# Altium project RiskChemi_Sensors_V2.03.PrjPcb
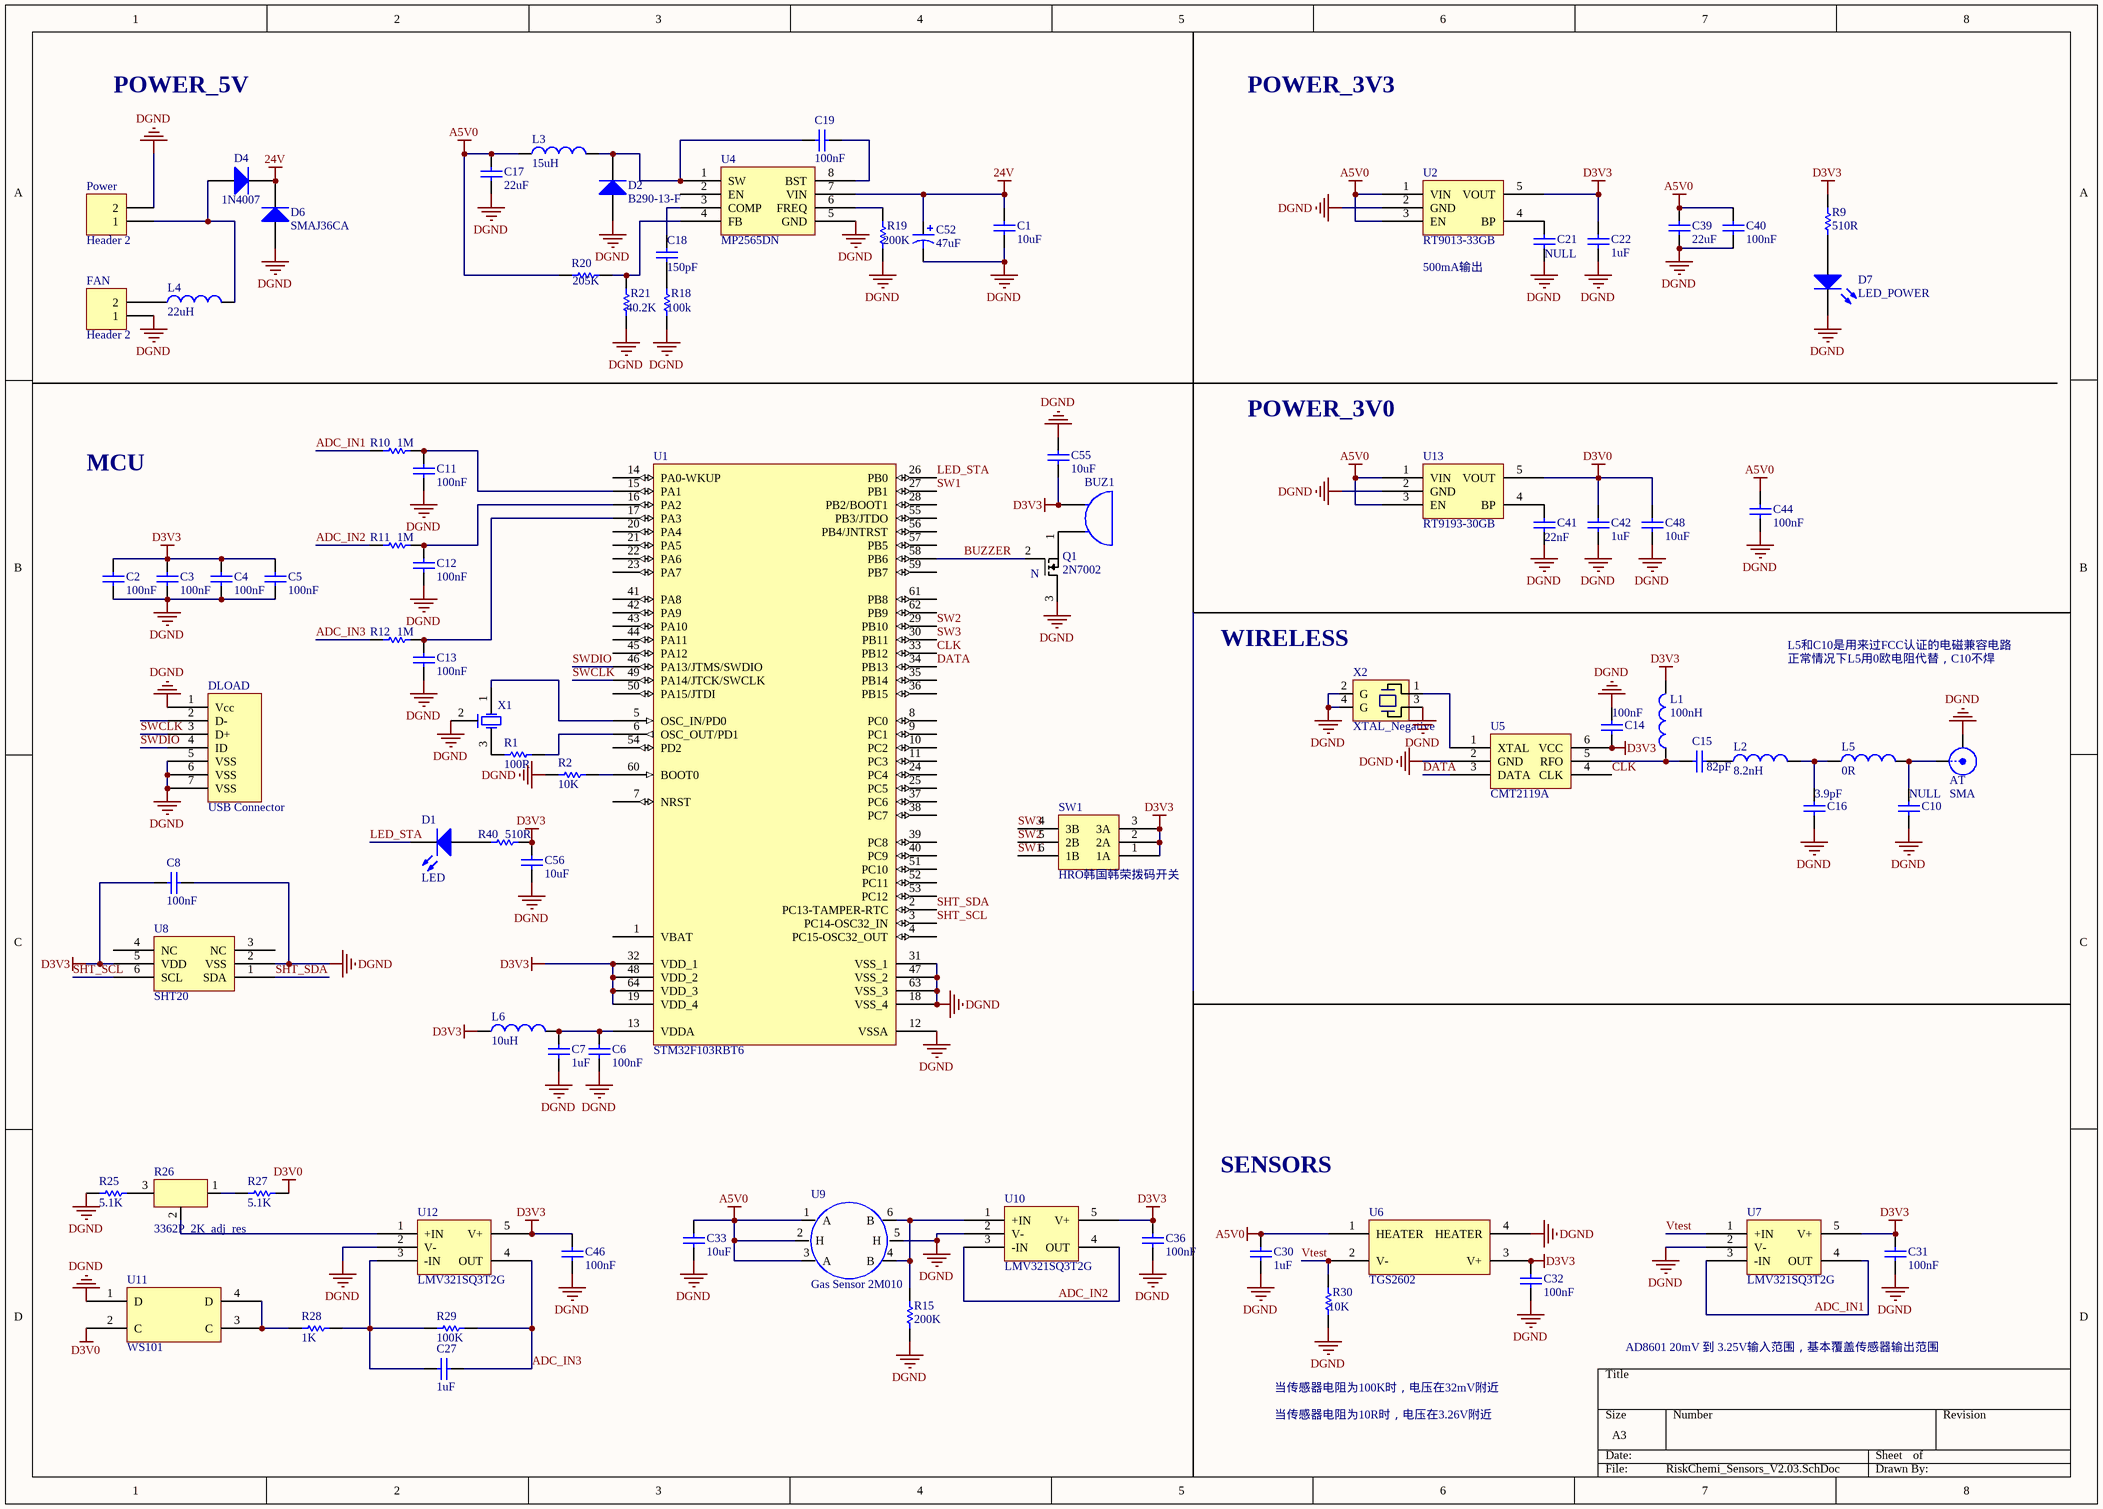
[diagram p0: RiskChemi_Sensors_V2.03.SchDoc]
1 sheet, 86 parts. Net scope: global (net labels, ports and power ports of the same name join across sheets).
Board file: RiskChemi_Sensors_V2.03.PcbDoc

## Sheet RiskChemi_Sensors_V2.03.SchDoc
size A3

### Parts
AT  SMA  [SMA]
BUZ1  BUZZER 0905 through hole  [BUZ0905]  (value not drawn)
C1  10uF  [0805]
C2  100nF  [0603]
C3  100nF  [0603]
C4  100nF  [0603]
C5  100nF  [0603]
C6  100nF  [0603]
C7  1uF  [0603]
C8  100nF  [0603]
C10  NULL  [0402]
C11  100nF  [0603]
C12  100nF  [0603]
C13  100nF  [0603]
C14  100nF  [0402]
C15  82pF  [0402]
C16  3.9pF  [0402]
C17  22uF  [0805]
C18  150pF  [0603]
C19  100nF  [0603]
C21  NULL  [0402]
C22  1uF  [0402]
C27  1uF  [0603]
C30  1uF  [0603]
C31  100nF  [0603]
C32  100nF  [0603]
C33  10uF  [0805]
C36  100nF  [0603]
C39  22uF  [1206]
C40  100nF  [0402]
C41  22nF  [0402]
C42  1uF  [0402]
C44  100nF  [0402]
C46  100nF  [0603]
C48  10uF  [0805]
C52  47uF  [cap_pol_8*10.2]
C55  10uF  [0805]
C56  10uF  [0805]
D1  LED  [1206_LED]
D2  B290-13-F  [B290]
D4  1N4007  [6032_pol]
D6  SMAJ36CA  [B290]
D7  LED_POWER  [1206_LED]
DLOAD  USB Connector  [Mini_USB]
FAN  Header 2  [HDR1X2]
L1  100nH  [0603C]
L2  8.2nH  [0603C]
L3  15uH  [4*4 Inductor]
L4  22uH  [10*10Inductor]
L5  0R  [0603C]
L6  10uH  [0805]
Power  Header 2  [HDR1X2]
Q1  2N7002  [2N7002]
R1  100R  [0603]
R2  10K  [0603]
R9  510R  [0603]
R10  1M  [0603]
R11  1M  [0603]
R12  1M  [0603]
R15  value 200K  [0603C]  (hidden comment: Res1)
R18  100k  [0603]
R19  200K  [0402]
R20  205K  [0603]
R21  40.2K  [0603]
R25  5.1K  [0603]
R26  3362P_2K_adj_res  [res_adj]
R27  5.1K  [0603]
R28  1K  [0603]
R29  100K  [0603]
R30  10K  [0603]
R40  510R  [0603]
SW1  HRO韩国韩荣拨码开关  [SW_6P_HRO]
U1  STM32F103RBT6  [LQFP64_N]
U2  RT9013-33GB  [SOT-23-5]
U4  MP2565DN  [so-8]
U5  CMT2119A  [sot23-6]
U6  TGS2602  [Gas Sensor TGS2602 Slot]
U7  LMV321SQ3T2G  [SC-70-5]
U8  SHT20  [SHT20]
U9  Gas Sensor 2M010  [Gas Sensor 2M010 Slot]
U10  LMV321SQ3T2G  [SC-70-5]
U11  WS101  [Gas_Sensor_WS101_Slot]
U12  LMV321SQ3T2G  [SC-70-5]
U13  RT9193-30GB  [SOT-23-5]
X1  8M smd  [8Mhz_XTAL]  (value not drawn)
X2  XTAL_Negative  [XTAL3225]

### Nets
24V: C1.2 C52.1 D4.2(K) D6.2(K) U4.7(VIN)
A5V0: C17.2 C30.2 C33.2 C39.1 C40.2 C44.2 L3.1 R20.2 U2.1(VIN) U2.3(EN) U6.1(HEATER) U9.1(A) U9.2(H) U9.3(A) U13.1(VIN) U13.3(EN)
D3V0: C42.2 C48.2 R27.2 U11.2(C) U13.5(VOUT)
D3V3: BUZ1.1(A) C2.2 C3.2 C4.2 C5.2 C8.2 C14.2 C22.2 C31.2 C32.2 C36.2 C46.2 C55.2 C56.2 L1.2 L6.1 R9.2 R40.2 SW1.1(1A) SW1.2(2A) SW1.3(3A) U1.19(VDD_4) U1.32(VDD_1) U1.48(VDD_2) U1.64(VDD_3) U2.5(VOUT) U5.6(VCC) U6.3(V+) U7.5(V+) U8.5(VDD) U10.5(V+) U12.5(V+)
DGND: AT.2(Y) C1.1 C2.1 C3.1 C4.1 C5.1 C6.1 C7.1 C8.1 C10.1 C11.2 C12.1 C13.1 C14.1 C16.1 C17.1 C21.1 C22.1 C30.1 C31.1 C32.1 C33.1 C36.1 C39.2 C40.1 C41.1 C42.1 C44.1 C46.1 C48.1 C52.2 C55.1 C56.1 D2.1(A) D6.1(A) D7.2(K) DLOAD.1(Vcc) DLOAD.5(VSS) DLOAD.6(VSS) DLOAD.7(VSS) FAN.1 Power.2 Q1.3(S) R2.1 R15.2 R18.1 R19.1 R21.1 R25.1 R30.1 U1.12(VSSA) U1.18(VSS_4) U1.31(VSS_1) U1.47(VSS_2) U1.63(VSS_3) U2.2(GND) U4.5(GND) U5.2(GND) U6.4(HEATER) U7.2(V-) U8.2(VSS) U9.5(H) U10.2(V-) U11.1(D) U12.2(V-) U13.2(GND) X1.2(GND) X2.2(G) X2.3 X2.4(G)
ADC_IN1: R10.1 U7.3(-IN) U7.4(OUT)
ADC_IN2: R11.1 U10.3(-IN) U10.4(OUT)
ADC_IN3: C27.1 R12.1 R29.2 U12.4(OUT)
BUZZER: Q1.2(G) U1.58(PB6)
CLK: U1.33(PB12) U5.4(CLK)
DATA: U1.34(PB13) U5.3(DATA)
LED_STA: D1.2(K) U1.26(PB0)
SHT_SCL: U1.3(PC14-OSC32_IN) U8.6(SCL)
SHT_SDA: U1.2(PC13-TAMPER-RTC) U8.1(SDA)
SW1: SW1.6(1B) U1.27(PB1)
SW2: SW1.5(2B) U1.29(PB10)
SW3: SW1.4(3B) U1.30(PB11)
SWCLK: DLOAD.3(D+) U1.49(PA14/JTCK/SWCLK)
SWDIO: DLOAD.4(ID) U1.46(PA13/JTMS/SWDIO)
Vtest: R30.2 U6.2(V-) U7.1(+IN)
NetAT_1: AT.1(X) C10.2 L5.2
NetBUZ1_2: BUZ1.2(B) Q1.1(D)
NetC6_2: C6.2 C7.2 L6.2 U1.13(VDDA)
NetC11_1: C11.1 R10.2 U1.15(PA1)
NetC12_2: C12.2 R11.2 U1.16(PA2)
NetC13_2: C13.2 R12.2 U1.17(PA3)
NetC15_1: C15.1 L1.1 U5.5(RFO)
NetC15_2: C15.2 L2.1
NetC16_2: C16.2 L2.2 L5.1
NetC18_1: C18.1 U4.3(COMP)
NetC18_2: C18.2 R18.2
NetC19_1: C19.1 U4.8(BST)
NetC19_2: C19.2 D2.2(K) L3.2 U4.1(SW)
NetC21_2: C21.2 U2.4(BP)
NetC27_2: C27.2 R28.2 R29.1 U12.3(-IN)
NetC41_2: C41.2 U13.4(BP)
NetD1_1: D1.1(A) R40.1
NetD4_1: D4.1(A) L4.2 Power.1
NetD7_1: D7.1(A) R9.1
NetFAN_2: FAN.2 L4.1
NetR1_1: R1.1 X1.3(OSC2)
NetR1_2: R1.2 U1.6(OSC_OUT/PD1)
NetR2_2: R2.2 U1.60(BOOT0)
NetR15_1: R15.1 U9.4(B) U9.6(B) U10.1(+IN)
NetR19_2: R19.2 U4.6(FREQ)
NetR20_1: R20.1 R21.2 U4.4(FB)
NetR25_2: R25.2 R26.3
NetR26_1: R26.1 R27.1
NetR26_2: R26.2 U12.1(+IN)
NetR28_1: R28.1 U11.3(C) U11.4(D)
NetU1_5: U1.5(OSC_IN/PD0) X1.1(OSC1)
NetU5_1: U5.1(XTAL) X2.1

Not connected (* = marked no-connect by the designer): DLOAD 2(D-); U1 1(VBAT) 4(PC15-OSC32_OUT) 7(NRST) 8(PC0) 9(PC1) 10(PC2) 11(PC3) 14(PA0-WKUP) 20(PA4) 21(PA5) 22(PA6) 23(PA7) 24(PC4) 25(PC5) 28(PB2/BOOT1) 35(PB14) 36(PB15) 37(PC6) 38(PC7) 39(PC8) 40(PC9) 41(PA8) 42(PA9) 43(PA10) 44(PA11) 45(PA12) 50(PA15/JTDI) 51(PC10) 52(PC11) 53(PC12) 54(PD2) 55(PB3/JTDO) 56(PB4/JNTRST) 57(PB5) 59(PB7) 61(PB8) 62(PB9); U4 2(EN); U8 3(NC) 4(NC)

### Notes on the sheet
- POWER_5V
- POWER_3V3
- (near U2) 500mA输出
- POWER_3V0
- MCU
- (near X2) WIRELESS
- L5和C10是用来过FCC认证的电磁兼容电路
- 正常情况下L5用0欧电阻代替，C10不焊
- SENSORS
- 当传感器电阻为100K时，电压在32mV附近
- AD8601 20mV 到 3.25V输入范围，基本覆盖传感器输出范围
- 当传感器电阻为10R时，电压在3.26V附近
- (in symbol N-MOSFET) N

### Library data of the parts
AT = SMB: SMB Straight Connector; LatestRevisionDate: 17-Jul-2002; LatestRevisionNote: Re-released for DXP Platform.; Publisher: Altium Limited
BUZ1 = BUZZER
C1 C17 = Cap: Capacitor,50V; Value: 100pF; Published: 8-Jun-2000; LatestRevisionDate: 17-Jul-2002; LatestRevisionNote: Re-released for DXP Platform.; PackageReference: RAD-0.3; Publisher: Altium Limited; PackageDescription: Radial Cap, Thru-Hole; 2 Leads; 0.3 in Pin Spacing
C2-C8 C11-C13 C18 C19 C21 C22 C27 C31 C32 C36 C39-C42 C44 C46 C48 C55 C56 = Cap: Capacitor; Value: 100pF; Published: 8-Jun-2000; Publisher: Altium Limited
  C2-C8 C11-C13 C18 C19 C21 C22 C27 C31 C32 C36 C40-C42 C44 C46 C48 C55 C56: LatestRevisionDate: 17-Jul-2002; LatestRevisionNote: Re-released for DXP Platform.; PackageReference: RAD-0.3; PackageDescription: Radial Cap, Thru-Hole; 2 Leads; 0.3 in Pin Spacing
  C39: Revision: July-2002: Re-released for DXP Platform.
C10 = Cap: Capacitor; Value: 3.9pF; Published: 8-Jun-2000; LatestRevisionDate: 17-Jul-2002; LatestRevisionNote: Re-released for DXP Platform.; PackageReference: RAD-0.3; Publisher: Altium Limited; PackageDescription: Radial Cap, Thru-Hole; 2 Leads; 0.3 in Pin Spacing
C14 = Cap: Capacitor; Value: 100nF,25V X7R; Published: 8-Jun-2000; LatestRevisionDate: 17-Jul-2002; LatestRevisionNote: Re-released for DXP Platform.; PackageReference: RAD-0.3; Publisher: Altium Limited; PackageDescription: Radial Cap, Thru-Hole; 2 Leads; 0.3 in Pin Spacing
C15 C16 C30 = Cap: Capacitor; Published: 8-Jun-2000; LatestRevisionDate: 17-Jul-2002; LatestRevisionNote: Re-released for DXP Platform.; PackageReference: RAD-0.3; Publisher: Altium Limited; PackageDescription: Radial Cap, Thru-Hole; 2 Leads; 0.3 in Pin Spacing
  C15: Value: 82pF
  C16: Value: 3.9pF
  C30: Value: 1uF
C33 = Cap: Capacitor; Value: 1uF; Published: 8-Jun-2000; LatestRevisionDate: 17-Jul-2002; LatestRevisionNote: Re-released for DXP Platform.; PackageReference: RAD-0.3; Publisher: Altium Limited; PackageDescription: Radial Cap, Thru-Hole; 2 Leads; 0.3 in Pin Spacing
C52 = Cap Pol1: Polarized Capacitor (Radial); Value: 100pF; Published: 8-Jun-2000; LatestRevisionDate: 17-Jul-2002; LatestRevisionNote: Re-released for DXP Platform.; PackageReference: RB7.6-15; Publisher: Altium Limited; PackageDescription: Polarized Capacitor (Radial); 2 Leads
D1 D7 = LED0: Typical INFRARED GaAs LED; Published: 8-Jun-2000; LatestRevisionDate: 08-Jul-2005; LatestRevisionNote: Mech Layer 1 removed.; PackageReference: LED-0; Publisher: Altium Limited; PackageDescription: LED; 2 Leads
D2 = Diode: Default Diode; Published: 8-Jun-2000; LatestRevisionDate: 17-Jul-2002; LatestRevisionNote: Re-released for DXP Platform.; PackageVersion: Sep-1996; PackageReference: SMC; Publisher: Altium Limited; PackageDescription: DO-214-AB/SMC; 2 C-Bend Leads; Body 7.9 x 5.9 mm, inc. leads (LxW); Code_JEDEC: DO-214-AB
D4 = Diode 1N4007: 1 Amp General Purpose Rectifier; Published: 8-Jun-2000; LatestRevisionDate: 17-Jul-2002; LatestRevisionNote: Re-released for DXP Platform.; DatasheetVersion: 1998; PackageVersion: Aug-1999; PackageReference: DO-41; Publisher: Altium Limited; PackageDescription: Diode, Axial; Body 5.2 x 2.7 mm (LxDia. max), Lead Dia. 0.86 mm (max); Code_JEDEC: DO-204-AL; ComponentLink1Description: Manufacturer Link; ComponentLink1URL: http://www.fairchildsemi.com/; ComponentLink2Description: Datasheet; ComponentLink2URL: http://www.fairchildsemi.com/ds/1N%2F1N4001.pdf
D6 = Diode 1N4007: 1 Amp General Purpose Rectifier; pin to pad: 1>2 2>1; Published: 8-Jun-2000; LatestRevisionDate: 17-Jul-2002; LatestRevisionNote: Re-released for DXP Platform.; DatasheetVersion: 1998; PackageVersion: Aug-1999; PackageReference: DO-41; Publisher: Altium Limited; PackageDescription: Diode, Axial; Body 5.2 x 2.7 mm (LxDia. max), Lead Dia. 0.86 mm (max); Code_JEDEC: DO-204-AL; ComponentLink1Description: Manufacturer Link; ComponentLink1URL: http://www.fairchildsemi.com/; ComponentLink2Description: Datasheet; ComponentLink2URL: http://www.fairchildsemi.com/ds/1N%2F1N4001.pdf
DLOAD = Component_1
FAN Power = Header 2: Header, 2-Pin; LatestRevisionDate: 17-Jul-2002; LatestRevisionNote: Re-released for DXP Platform.; Publisher: Altium Limited
L1 L2 = Inductor: Code_IEC: 1005; Published: 8-Jun-2000; LatestRevisionDate: 29-May-2009; LatestRevisionNote: IPC-7351 Footprint Added.; PackageReference: 0402-A; Publisher: Altium Limited; PackageDescription: Chip Inductor; Code_JEITA: 0402
  L1: Value: 100nH
  L2: Value: 8.2nH
L3 = Inductor: Inductor, 1A; Code_IEC: 1005; Published: 8-Jun-2000; LatestRevisionDate: 29-May-2009; LatestRevisionNote: IPC-7351 Footprint Added.; PackageReference: 0402-A; Publisher: Altium Limited; PackageDescription: Chip Inductor; Code_JEITA: 0402; Value: 15uH
L4 = Inductor: Inductor, 1A; Code_IEC: 1005; Value: 15uH; Published: 8-Jun-2000; LatestRevisionDate: 29-May-2009; LatestRevisionNote: IPC-7351 Footprint Added.; PackageReference: 0402-A; Publisher: Altium Limited; PackageDescription: Chip Inductor; Code_JEITA: 0402
L5 L6 = Inductor: Code_IEC: 1005; Value: 8.2nH; Published: 8-Jun-2000; LatestRevisionDate: 29-May-2009; LatestRevisionNote: IPC-7351 Footprint Added.; PackageReference: 0402-A; Publisher: Altium Limited; PackageDescription: Chip Inductor; Code_JEITA: 0402
Q1 = N-MOSFET
R1 = Res1: Resistor; Value: 100; Published: 8-Jun-2000; LatestRevisionDate: 17-Jul-2002; LatestRevisionNote: Re-released for DXP Platform.; PackageReference: AXIAL-0.3; Publisher: Altium Limited; PackageDescription: Axial Device, Thru-Hole; 2 Leads; 0.3 in Pin Spacing
R2 R15 R19 R21 R30 = Res1: Resistor; Published: 8-Jun-2000; LatestRevisionDate: 17-Jul-2002; LatestRevisionNote: Re-released for DXP Platform.; PackageReference: AXIAL-0.3; Publisher: Altium Limited
  R2 R30: PackageDescription: Axial Device, Thru-Hole; 2 Leads; 0.3 in Pin Spacing; Value: 10K
  R15: PackageDescription: Axial Device, Thru-Hole; 2 Leads; 0.3 in Pin Spacing
  R19: Value: 200K
  R21: Value: 40.2K
R9-R12 R40 = Res1: Resistor; Value: 1K; Published: 8-Jun-2000; LatestRevisionDate: 17-Jul-2002; LatestRevisionNote: Re-released for DXP Platform.; PackageReference: AXIAL-0.3; Publisher: Altium Limited; PackageDescription: Axial Device, Thru-Hole; 2 Leads; 0.3 in Pin Spacing
R18 = Res1: Resistor; Value: 47.5K; Published: 8-Jun-2000; LatestRevisionDate: 17-Jul-2002; LatestRevisionNote: Re-released for DXP Platform.; PackageReference: AXIAL-0.3; Publisher: Altium Limited
R20 = Res1: Resistor; Value: 210K; Published: 8-Jun-2000; LatestRevisionDate: 17-Jul-2002; LatestRevisionNote: Re-released for DXP Platform.; PackageReference: AXIAL-0.3; Publisher: Altium Limited
R25 R27-R29 = Res1: Resistor; Value: 10K; Published: 8-Jun-2000; LatestRevisionDate: 17-Jul-2002; LatestRevisionNote: Re-released for DXP Platform.; PackageReference: AXIAL-0.3; Publisher: Altium Limited; PackageDescription: Axial Device, Thru-Hole; 2 Leads; 0.3 in Pin Spacing
R26 = res_adj
SW1 = SW_6P
U1 = STM32F103R8T6: STM32 ARM-based 32-bit MCU with 64 Kbytes Flash, 64-pin LQFP, Industrial Temperature; Published: 30-May-2008; DatasheetVersion: rev6, Mar-2008; PackageVersion: Mar-2008; PackageReference: LQFP64; Publisher: Altium Limited; PackageDescription: 64-Pin Low-Profile Quad Flat Pack, 10 x 10 mm Body, 0.5 mm Pitch (LQFP64); ComponentLink1Description: Manufacturer Link; ComponentLink1URL: www.st.com/stm32; ComponentLink2Description: Datasheet; ComponentLink2URL: http://www.st.com/stonline/products/literature/ds/13587.pdf
U2 U13 = RT9193
U4 = MP1584: DCDC 4.5V~28V input 1.8V ~5V output low power; Manufacture: MPS
U6 = TGS2602: VOC sensor
U9 = Gas Sensor
U11 = Gas Sensor_WS101